# EAGLE design tiny_midi_brk (EAGLE 9.6.2)
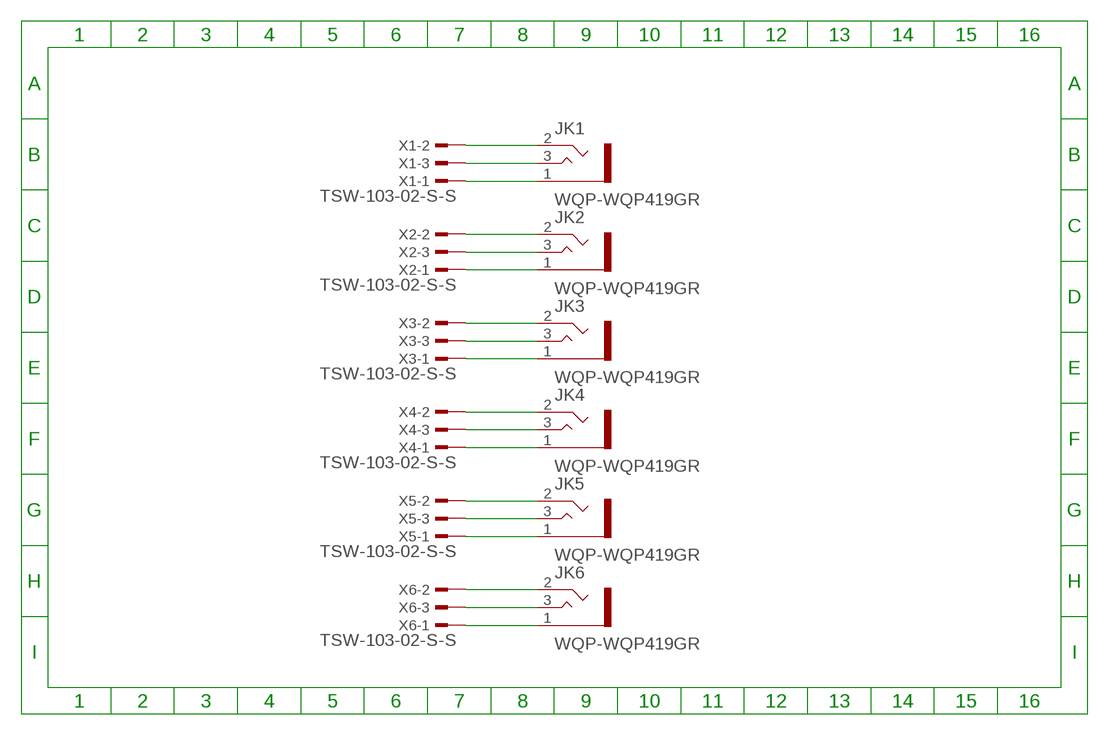
[diagram p0: schematic, sheet 1]

## Parts
JK1  WQP-WQP419GR  [WQP-PJ301M-12_JACK_TRS]
JK2  WQP-WQP419GR  [WQP-PJ301M-12_JACK_TRS]
JK3  WQP-WQP419GR  [WQP-PJ301M-12_JACK_TRS]
JK4  WQP-WQP419GR  [WQP-PJ301M-12_JACK_TRS]
JK5  WQP-WQP419GR  [WQP-PJ301M-12_JACK_TRS]
JK6  WQP-WQP419GR  [WQP-PJ301M-12_JACK_TRS]
X1  TSW-103-02-S-S  [TSW-103-02-S-S]
X2  TSW-103-02-S-S  [TSW-103-02-S-S]
X3  TSW-103-02-S-S  [TSW-103-02-S-S]
X4  TSW-103-02-S-S  [TSW-103-02-S-S]
X5  TSW-103-02-S-S  [TSW-103-02-S-S]
X6  TSW-103-02-S-S  [TSW-103-02-S-S]

## Nets
N$1: JK1.1 X1.1
N$2: JK1.2 X1.2
N$3: JK1.3 X1.3
N$4: JK2.1 X2.1
N$5: JK2.2 X2.2
N$6: JK2.3 X2.3
N$7: JK3.1 X3.1
N$8: JK3.2 X3.2
N$9: JK3.3 X3.3
N$10: JK4.1 X4.1
N$11: JK4.2 X4.2
N$12: JK4.3 X4.3
N$13: JK5.1 X5.1
N$14: JK5.2 X5.2
N$15: JK5.3 X5.3
N$16: JK6.1 X6.1
N$17: JK6.2 X6.2
N$18: JK6.3 X6.3

## Library data of the parts
JK1-JK6 = thonkiconn:WQP-WQP419GR
X1-X6 = con-samtec:TSW-103-02-S-S: THROUGH-HOLE .025" SQ POST HEADER Source: Samtec TSW.pdf; OC_FARNELL: unknown; OC_NEWARK: unknown

## Board
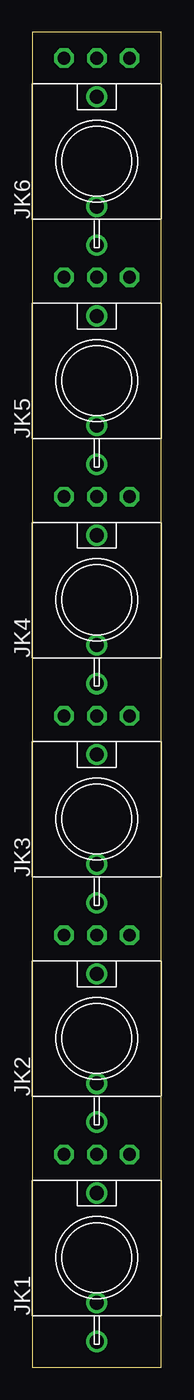
[diagram p1: board, top side]
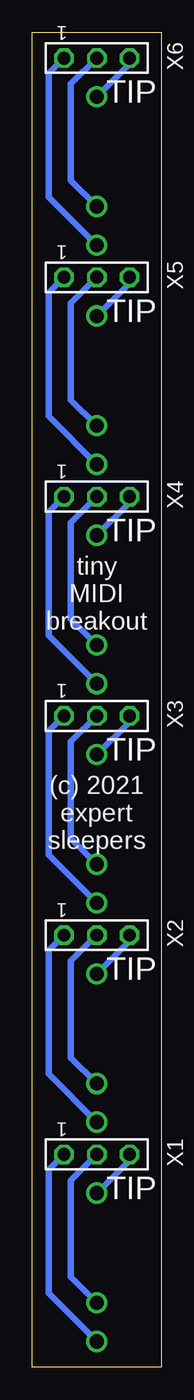
[diagram p2: board, bottom side, seen from below]

Size 10 x 103.5 mm. Coordinates in mm from the lower left corner, seen from the top.
Outline: 10,0 10,103.5 0,103.5 0,0 10,0
Copper layers (1*16): Top 0.035mm / dielectric 1.5mm / Bottom 0.035mm
Design rules "default": minimum track width 6mil, minimum drill 0.35mm, track to track 6mil, track to pad 6mil, pad to pad 6mil, via to via 6mil, smd to smd 6mil, copper to edge 40mil, drill to drill 6mil, minimum pad ring 10mil, minimum via ring 8mil, stop-mask expansion 4mil, vias tented up to drill 0mil, thermal gap 10mil

### Footprints (pad centres in the part's own frame; a part is rotated, then mirrored left to right if it is on the bottom)
WQP-PJ301M-12_JACK_TRS = drill 1.1: 1 0,-6.5; 2 0,-3.5; 3 0,5
TSW-103-02-S-S = drill 1 pad 1.5 octagon: 1 2.54,0; 2 0,0; 3 -2.54,0

### Placement (x,y rotation side)
JK1  5,8.5 0 top
JK2  5,25.5 0 top
JK3  5,42.5 0 top
JK4  5,59.5 0 top
JK5  5,76.5 0 top
JK6  5,93.5 0 top
X1  5,16.5 180 bottom
X2  5,33.5 180 bottom
X3  5,50.5 180 bottom
X4  5,67.5 180 bottom
X5  5,84.5 180 bottom
X6  5,101.5 180 bottom

### Tracks (layer width: path | path; a pad name or v marks a point on that pad's centre or on a via)
N$1
  Bottom 0.508: X1.1 8.73,15.31 8.73,5.73 JK1.1
N$2
  Bottom 0.508: X1.2 7,14.5 7,7 JK1.2
N$3
  Bottom 0.508: X1.3 2.46,16.04 JK1.3
N$4
  Bottom 0.508: X2.1 8.73,32.31 8.73,22.73 JK2.1
N$5
  Bottom 0.508: X2.2 7,31.5 7,24 JK2.2
N$6
  Bottom 0.508: X2.3 2.46,33.04 JK2.3
N$7
  Bottom 0.508: X3.1 8.73,49.31 8.73,39.73 JK3.1
N$8
  Bottom 0.508: X3.2 7,48.5 7,41 JK3.2
N$9
  Bottom 0.508: X3.3 2.46,50.04 JK3.3
N$10
  Bottom 0.508: X4.1 8.73,66.31 8.73,56.73 JK4.1
N$11
  Bottom 0.508: X4.2 7,65.5 7,58 JK4.2
N$12
  Bottom 0.508: X4.3 2.46,67.04 JK4.3
N$13
  Bottom 0.508: X5.1 8.73,83.31 8.73,73.73 JK5.1
N$14
  Bottom 0.508: X5.2 7,82.5 7,75 JK5.2
N$15
  Bottom 0.508: X5.3 2.46,84.04 JK5.3
N$16
  Bottom 0.508: X6.1 8.73,100.31 8.73,90.73 JK6.1
N$17
  Bottom 0.508: X6.2 7,99.5 7,92 JK6.2
N$18
  Bottom 0.508: X6.3 2.46,101.04 JK6.3

### Text on the board
bPlace: TIP | TIP | TIP | tiny / MIDI / breakout | TIP | (c) 2021 / expert / sleepers | TIP | TIP